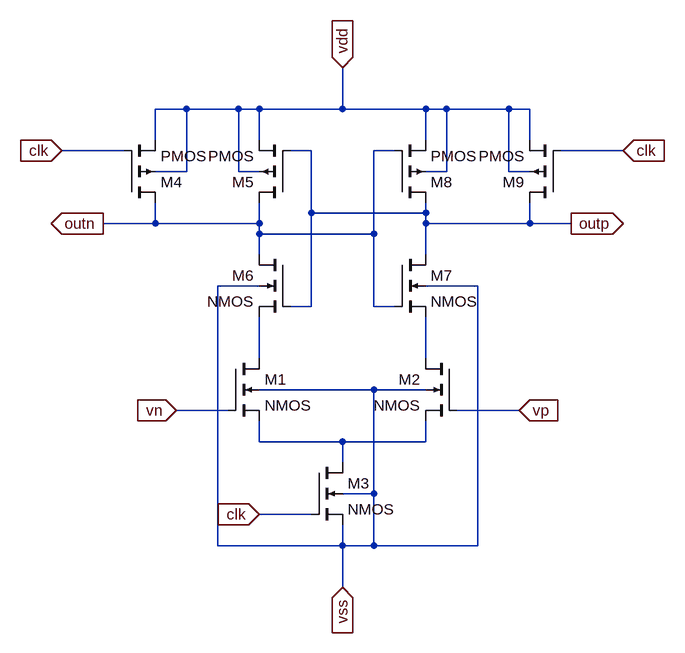
[diagram p0: schematic my_comparator2.asc]
my_comparator2.asc, the LTspice schematic file:
Version 4
SHEET 1 936 680
WIRE 160 -224 112 -224
WIRE 240 -224 160 -224
WIRE 272 -224 240 -224
WIRE 400 -224 400 -288
WIRE 400 -224 272 -224
WIRE 528 -224 400 -224
WIRE 560 -224 528 -224
WIRE 656 -224 560 -224
WIRE 688 -224 656 -224
WIRE 112 -176 112 -224
WIRE 272 -176 272 -224
WIRE 528 -176 528 -224
WIRE 688 -176 688 -224
WIRE 64 -160 -32 -160
WIRE 352 -160 320 -160
WIRE 480 -160 448 -160
WIRE 832 -160 736 -160
WIRE 160 -128 160 -224
WIRE 160 -128 112 -128
WIRE 240 -128 240 -224
WIRE 272 -128 240 -128
WIRE 560 -128 560 -224
WIRE 560 -128 528 -128
WIRE 656 -128 656 -224
WIRE 688 -128 656 -128
WIRE 352 -64 352 -160
WIRE 528 -64 528 -80
WIRE 528 -64 352 -64
WIRE 112 -48 112 -80
WIRE 112 -48 32 -48
WIRE 272 -48 272 -80
WIRE 272 -48 112 -48
WIRE 528 -48 528 -64
WIRE 688 -48 688 -80
WIRE 688 -48 528 -48
WIRE 752 -48 688 -48
WIRE 272 -32 272 -48
WIRE 448 -32 448 -160
WIRE 448 -32 272 -32
WIRE 272 0 272 -32
WIRE 528 0 528 -48
WIRE 272 48 208 48
WIRE 608 48 528 48
WIRE 352 80 352 -64
WIRE 352 80 320 80
WIRE 448 80 448 -32
WIRE 480 80 448 80
WIRE 272 160 272 96
WIRE 528 160 528 96
WIRE 448 208 272 208
WIRE 528 208 448 208
WIRE 224 240 144 240
WIRE 672 240 576 240
WIRE 272 288 272 256
WIRE 400 288 272 288
WIRE 528 288 528 256
WIRE 528 288 400 288
WIRE 400 320 400 288
WIRE 448 368 448 208
WIRE 448 368 400 368
WIRE 352 400 272 400
WIRE 208 448 208 48
WIRE 400 448 400 416
WIRE 400 448 208 448
WIRE 448 448 448 368
WIRE 448 448 400 448
WIRE 608 448 608 48
WIRE 608 448 448 448
WIRE 400 512 400 448
FLAG 400 -288 vdd
IOPIN 400 -288 In
FLAG -32 -160 clk
IOPIN -32 -160 In
FLAG 832 -160 clk
IOPIN 832 -160 In
FLAG 272 400 clk
IOPIN 272 400 In
FLAG 672 240 vp
IOPIN 672 240 In
FLAG 144 240 vn
IOPIN 144 240 In
FLAG 32 -48 outn
IOPIN 32 -48 Out
FLAG 752 -48 outp
IOPIN 752 -48 Out
FLAG 400 512 vss
IOPIN 400 512 In
SYMBOL nmos4 224 160 R0
SYMATTR InstName M1
SYMBOL nmos4 576 160 M0
SYMATTR InstName M2
SYMBOL nmos4 352 320 R0
SYMATTR InstName M3
SYMBOL pmos4 64 -80 M180
SYMATTR InstName M4
SYMBOL pmos4 320 -80 R180
SYMATTR InstName M5
SYMBOL nmos4 320 0 M0
SYMATTR InstName M6
SYMBOL nmos4 480 0 R0
SYMATTR InstName M7
SYMBOL pmos4 480 -80 M180
SYMATTR InstName M8
SYMBOL pmos4 736 -80 R180
SYMATTR InstName M9

The netlist it stands for:
* my_comparator2.asc
M1 N001 vn N003 vss NMOS
M2 N002 vp N003 vss NMOS
M3 N003 clk vss vss NMOS
M4 outn clk vdd vdd PMOS
M5 outn outp vdd vdd PMOS
M6 outn outp N001 vss NMOS
M7 outp outn N002 vss NMOS
M8 outp outn vdd vdd PMOS
M9 outp clk vdd vdd PMOS
.model NMOS NMOS
.model PMOS PMOS
.lib standard.mos
.backanno
.end